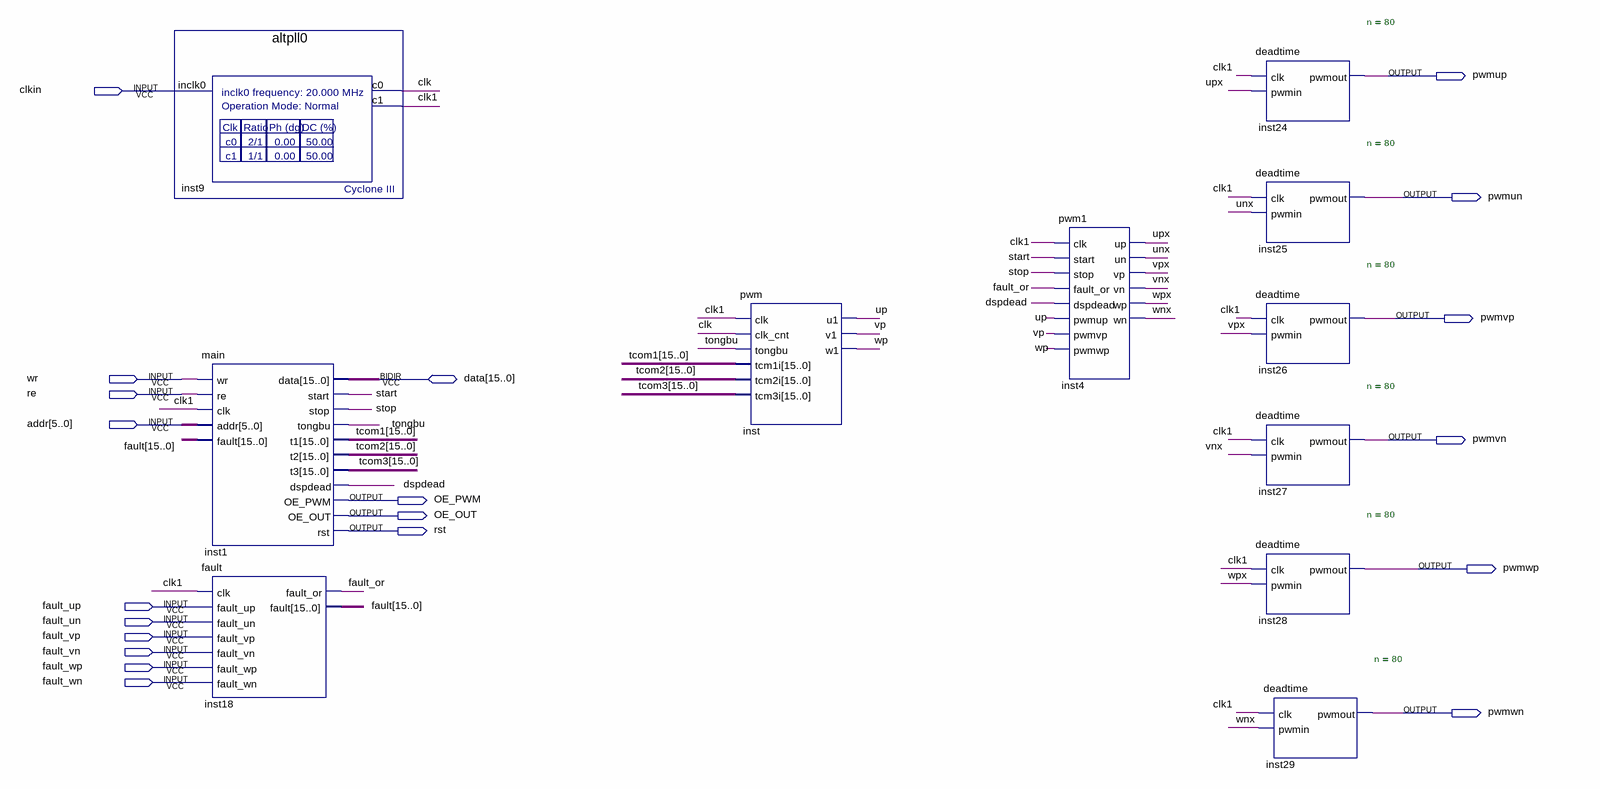
[diagram p0: schematic sheet]
// Quartus schematic svpwm.bdf as structural Verilog: 11 symbols, 20 pins
module svpwm (
  input  clkin,
  input  wr,
  input  re,
  input  [5:0] addr,
  input  fault_up,
  input  fault_un,
  input  fault_vp,
  input  fault_vn,
  input  fault_wp,
  input  fault_wn,
  inout  [15:0] data,
  output pwmup,
  output pwmun,
  output pwmvp,
  output pwmvn,
  output OE_PWM,
  output OE_OUT,
  output rst,
  output pwmwp,
  output pwmwn
);

  wire clk, clk1, dspdead, fault_or, start, stop, tongbu, unx, up, upx, vnx, vp, vpx, wnx, wp, wpx;
  wire [15:0] fault, tcom1, tcom2, tcom3;

  altpll0 inst9 (.inclk0(clkin), .c0(clk), .c1(clk1));
  main inst1 (
    .wr(wr), .re(re), .clk(clk1), .addr(addr), .fault(fault), .start(start), .stop(stop), .tongbu(tongbu),
    .t1(tcom1), .t2(tcom2), .t3(tcom3), .dspdead(dspdead), .OE_PWM(OE_PWM), .OE_OUT(OE_OUT), .rst(rst),
    .data(data));
  fault inst18 (
    .clk(clk1), .fault_up(fault_up), .fault_un(fault_un), .fault_vp(fault_vp), .fault_vn(fault_vn),
    .fault_wp(fault_wp), .fault_wn(fault_wn), .fault_or(fault_or), .fault(fault));
  pwm inst (
    .clk(clk1), .clk_cnt(clk), .tongbu(tongbu), .tcm1i(tcom1), .tcm2i(tcom2), .tcm3i(tcom3), .u1(up),
    .v1(vp), .w1(wp));
  pwm1 inst4 (
    .clk(clk1), .start(start), .stop(stop), .fault_or(fault_or), .dspdead(dspdead), .pwmup(up), .pwmvp(vp),
    .pwmwp(wp), .up(upx), .un(unx), .vp(vpx), .vn(vnx), .wp(wpx), .wn(wnx));
  deadtime #(.n(80)) inst24 (.clk(clk1), .pwmin(upx), .pwmout(pwmup));
  deadtime #(.n(80)) inst25 (.clk(clk1), .pwmin(unx), .pwmout(pwmun));
  deadtime #(.n(80)) inst26 (.clk(clk1), .pwmin(vpx), .pwmout(pwmvp));
  deadtime #(.n(80)) inst27 (.clk(clk1), .pwmin(vnx), .pwmout(pwmvn));
  deadtime #(.n(80)) inst28 (.clk(clk1), .pwmin(wpx), .pwmout(pwmwp));
  deadtime #(.n(80)) inst29 (.clk(clk1), .pwmin(wnx), .pwmout(pwmwn));
endmodule
